# Altium schematic sheet EV_Schematics.SchDoc
size A3; SheetNumber: 1; SheetTotal: 8
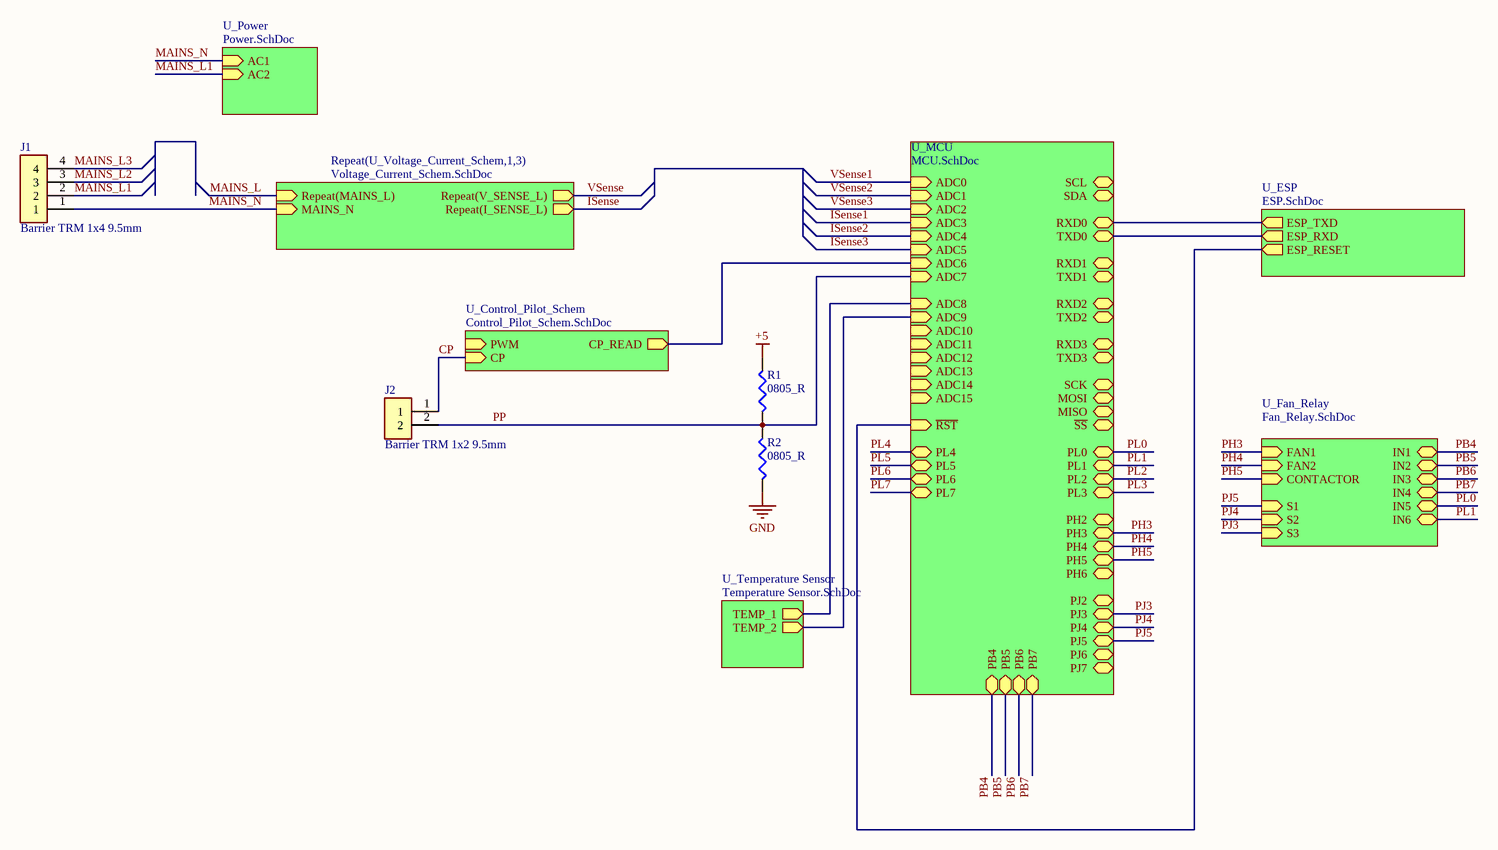
[diagram p0: EV_Schematics.SchDoc]

## Parts
J1  Barrier TRM 1x4 9.5mm  [BARRIER_4_9.5mm]
J2  Barrier TRM 1x2 9.5mm  [BARRIER_9.5MM]
R1  0805_R  [R0805]
R2  0805_R  [R0805]

## Sub-sheets
Repeat(U_Voltage_Current_Schem,1,3) = Voltage_Current_Schem.SchDoc: Repeat(MAINS_L) (in), MAINS_N (in), Repeat(V_SENSE_L) (out), Repeat(I_SENSE_L) (out)
U_Control_Pilot_Schem = Control_Pilot_Schem.SchDoc: PWM (in), CP_READ (out), CP (in)
U_ESP = ESP.SchDoc: ESP_TXD (out), ESP_RXD (out), ESP_RESET (out)
U_Fan_Relay = Fan_Relay.SchDoc: FAN1 (in), FAN2 (in), S1 (in), S2 (in), S3 (in), IN1 (bidir), IN2 (bidir), IN3 (bidir), IN4 (bidir), IN5 (bidir), IN6 (bidir), CONTACTOR (in)
U_MCU = MCU.SchDoc: SCL (bidir), ADC1 (in), ADC2 (in), ADC3 (in), ADC4 (in), ADC5 (in), ADC6 (in), ADC7 (in), ADC0 (in), ~{RST} (in), SDA (bidir), RXD1 (bidir), TXD1 (bidir), RXD0 (bidir), TXD0 (bidir), ~{SS} (bidir), SCK (bidir), MOSI (bidir), MISO (bidir), ADC9 (in), ADC10 (in), ADC11 (in), ADC12 (in), ADC13 (in), ADC14 (in), ADC15 (in), ADC8 (in), RXD3 (bidir), TXD3 (bidir), RXD2 (bidir), TXD2 (bidir), PL0 (bidir), PL1 (bidir), PL2 (bidir), PL3 (bidir), PL4 (bidir), PL5 (bidir), PL6 (bidir), PL7 (bidir), PB4 (bidir), PB7 (bidir), PB5 (bidir), PB6 (bidir), PH4 (bidir), PH2 (bidir), PH5 (bidir), PH6 (bidir), PH3 (bidir), PJ4 (bidir), PJ7 (bidir), PJ5 (bidir), PJ3 (bidir), PJ2 (bidir), PJ6 (bidir)
U_Power = Power.SchDoc: AC1 (in), AC2 (in)
U_Temperature Sensor = Temperature Sensor.SchDoc: TEMP_1 (out), TEMP_2 (out)

## Nets
+5: R1.2
GND: R2.1
CP: J2.1 ; sheet U_Control_Pilot_Schem/CP
ISense: sheet Repeat(U_Voltage_Current_Schem,1,3)/Repeat(I_SENSE_L)
ISense1: sheet U_MCU/ADC3
ISense2: sheet U_MCU/ADC4
ISense3: sheet U_MCU/ADC5
MAINS_L: sheet Repeat(U_Voltage_Current_Schem,1,3)/Repeat(MAINS_L)
MAINS_L1: J1.2 ; sheet U_Power/AC2
MAINS_L2: J1.3
MAINS_L3: J1.4
MAINS_N: J1.1 ; sheet U_Power/AC1, sheet Repeat(U_Voltage_Current_Schem,1,3)/MAINS_N
PB4: sheet U_Fan_Relay/IN1, sheet U_MCU/PB4
PB5: sheet U_Fan_Relay/IN2, sheet U_MCU/PB5
PB6: sheet U_Fan_Relay/IN3, sheet U_MCU/PB6
PB7: sheet U_Fan_Relay/IN4, sheet U_MCU/PB7
PH3: sheet U_Fan_Relay/FAN1, sheet U_MCU/PH3
PH4: sheet U_Fan_Relay/FAN2, sheet U_MCU/PH4
PH5: sheet U_Fan_Relay/CONTACTOR, sheet U_MCU/PH5
PJ3: sheet U_Fan_Relay/S3, sheet U_MCU/PJ3
PJ4: sheet U_Fan_Relay/S2, sheet U_MCU/PJ4
PJ5: sheet U_Fan_Relay/S1, sheet U_MCU/PJ5
PL0: sheet U_Fan_Relay/IN5, sheet U_MCU/PL0
PL1: sheet U_Fan_Relay/IN6, sheet U_MCU/PL1
PL2: sheet U_MCU/PL2
PL3: sheet U_MCU/PL3
PL4: sheet U_MCU/PL4
PL5: sheet U_MCU/PL5
PL6: sheet U_MCU/PL6
PL7: sheet U_MCU/PL7
PP: J2.2 R1.1 R2.2 ; sheet U_MCU/ADC7
VSense: sheet Repeat(U_Voltage_Current_Schem,1,3)/Repeat(V_SENSE_L)
VSense1: sheet U_MCU/ADC0
VSense2: sheet U_MCU/ADC1
VSense3: sheet U_MCU/ADC2
(unnamed): sheet U_Control_Pilot_Schem/CP_READ, sheet U_MCU/ADC6
(unnamed): sheet U_ESP/ESP_TXD, sheet U_MCU/RXD0
(unnamed): sheet U_ESP/ESP_RXD, sheet U_MCU/TXD0
(unnamed): sheet U_ESP/ESP_RESET, sheet U_MCU/~{RST}
(unnamed): sheet U_MCU/ADC9, sheet U_Temperature Sensor/TEMP_2
(unnamed): sheet U_MCU/ADC8, sheet U_Temperature Sensor/TEMP_1

## Library data of the parts
J1 = Barrier BLK_4: CONN BARRIER STRIP 4CIRC 0.374"; Manufacturer 1: On-Shore Technology; Manufacturer Part Number 1: OSTYK44102030; Current Rating: 30A; Voltage Rating: 300V; Parameter Name 1: Bulk; Number of Circuits: 2; Wire Gauge (Max): 22AWG; Wire Gauge (Min): 10AWG; Pitch: 0.374inch; Supplier 1: Digi-Key; Stock 1: 3505; Pricing 1: 1=1.22000, 10=0.76100, 25=0.65160, 50=0.58560, 100=0.57340, 250=0.48800, 500=0.46360, 1000=0.41480, 5000=0.32452 (USD); RoHS: Yes; Mount: Through Hole; Color: Black; Insulation Material: Nylon; Min Operating Temperature: -40°C; Max Operating Temperature: 105°C; Number of Rows: 1; Number of Wire Entries: 2; Flammability Rating: UL94 V-0; ComponentLink1URL: https://datasheet.ciiva.com/778/ostyk441xx030-778584.pdf?src-supplier=Digi-Key; ComponentLink1Description: https://datasheet.ciiva.com/778/ostyk441xx030-778584.pdf?src-supplier=Digi-Key; Supplier Part Number 1: ED2971-ND
J2 = Barrier BLK: CONN BARRIER STRIP 2CIRC 0.374"; Manufacturer 1: On-Shore Technology; Manufacturer Part Number 1: OSTYK44102030; Current Rating: 30A; Voltage Rating: 300V; Parameter Name 1: Bulk; Number of Circuits: 2; Wire Gauge (Max): 22AWG; Wire Gauge (Min): 10AWG; Pitch: 0.374inch; Supplier 1: Digi-Key; Stock 1: 3505; Pricing 1: 1=1.22000, 10=0.76100, 25=0.65160, 50=0.58560, 100=0.57340, 250=0.48800, 500=0.46360, 1000=0.41480, 5000=0.32452 (USD); RoHS: Yes; Mount: Through Hole; Color: Black; Insulation Material: Nylon; Min Operating Temperature: -40°C; Max Operating Temperature: 105°C; Number of Rows: 1; Number of Wire Entries: 2; Flammability Rating: UL94 V-0; ComponentLink1URL: https://datasheet.ciiva.com/778/ostyk441xx030-778584.pdf?src-supplier=Digi-Key; ComponentLink1Description: https://datasheet.ciiva.com/778/ostyk441xx030-778584.pdf?src-supplier=Digi-Key; Supplier Part Number 1: ED2971-ND
R1 R2 = 0805 Resistor